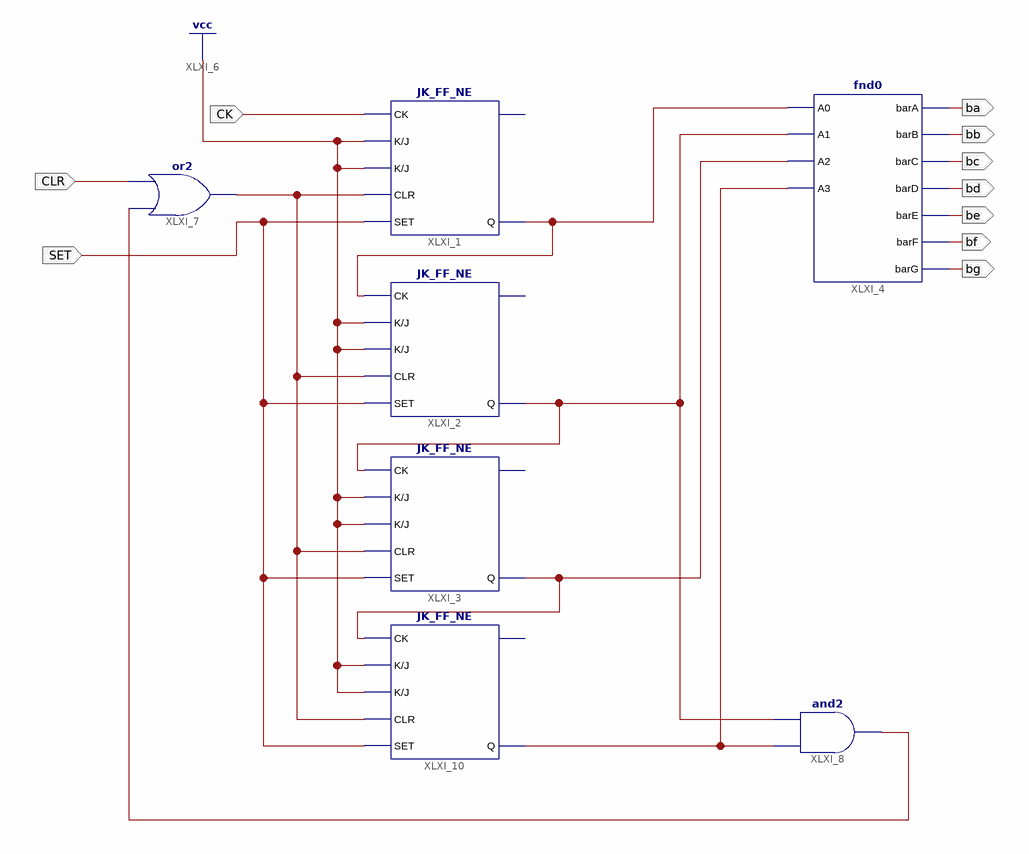
[diagram p0: schematic sheet 1]
// Xilinx ISE schematic Mod5_A.sch (spartan6) as structural Verilog: 7 symbols, 10 ports
module Mod5_A (
  input  CK,
  input  CLR,
  input  SET,
  output ba,
  output bb,
  output bc,
  output bd,
  output be,
  output bf,
  output bg
);

  wire XLXN_12, XLXN_14, XLXN_18, XLXN_28, XLXN_29, XLXN_31;

  JK_FF_NE XLXI_1 (.CK(CK), .K(1'b1), .J(1'b1), .CLR(XLXN_14), .SET(SET), .Q(XLXN_28));  // open: bQ
  JK_FF_NE XLXI_2 (.CK(XLXN_28), .K(1'b1), .J(1'b1), .CLR(XLXN_14), .SET(SET), .Q(XLXN_12));  // open: bQ
  JK_FF_NE XLXI_3 (.CK(XLXN_12), .K(1'b1), .J(1'b1), .CLR(XLXN_14), .SET(SET), .Q(XLXN_29));  // open: bQ
  fnd0 XLXI_4 (
    .A3(XLXN_31), .A2(XLXN_29), .A1(XLXN_12), .A0(XLXN_28), .barA(ba), .barB(bb), .barC(bc), .barD(bd),
    .barE(be), .barF(bf), .barG(bg));
  or XLXI_7 (XLXN_14, XLXN_18, CLR);
  and XLXI_8 (XLXN_18, XLXN_31, XLXN_12);
  JK_FF_NE XLXI_10 (.CK(XLXN_29), .K(1'b1), .J(1'b1), .CLR(XLXN_14), .SET(SET), .Q(XLXN_31));  // open: bQ
endmodule
